# EAGLE schematic *JustABatterie (EAGLE 7.2.0)
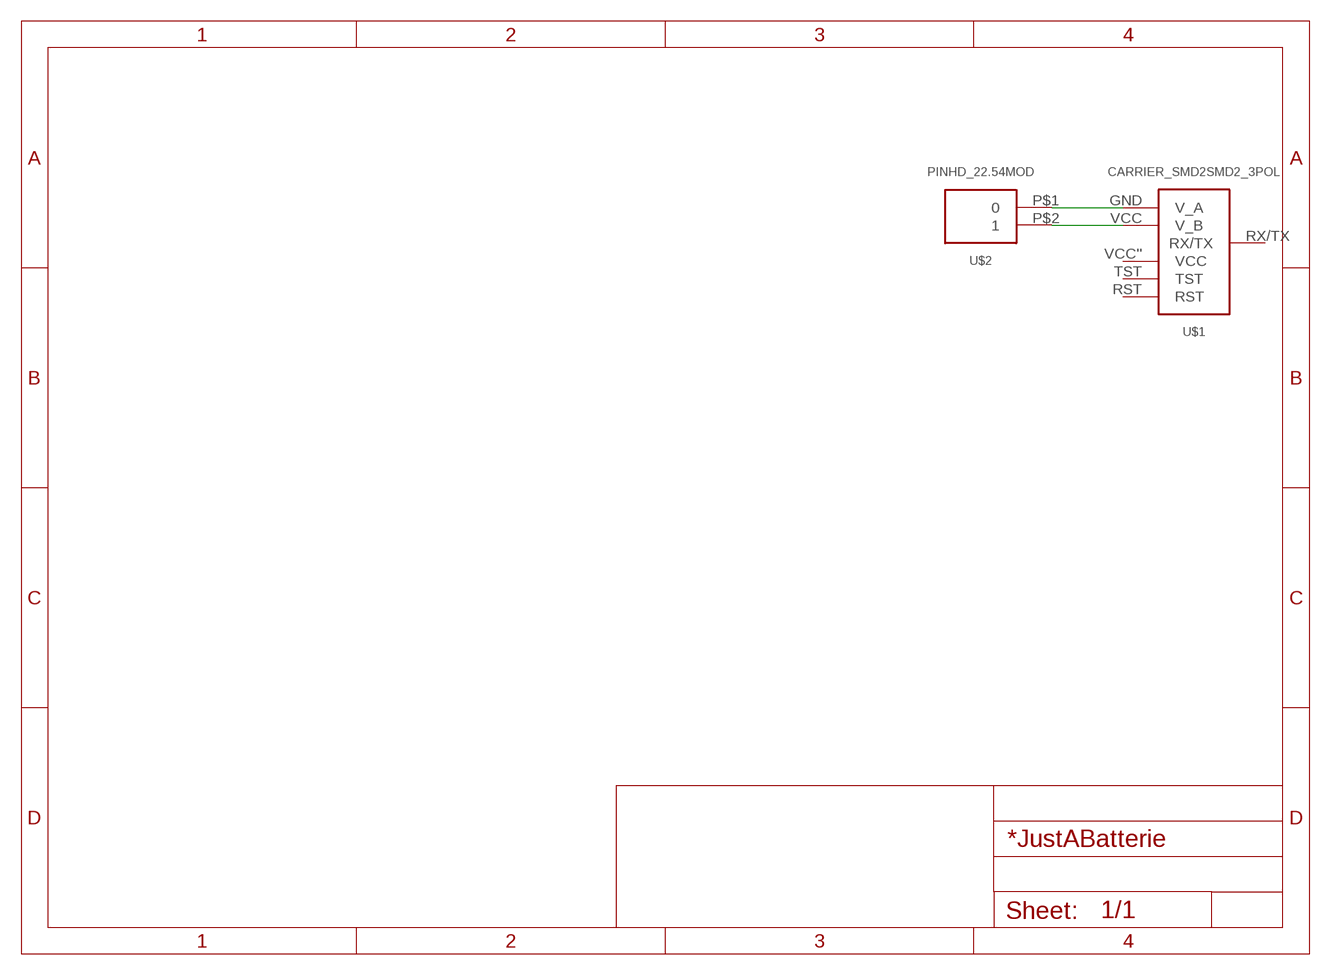
[diagram p0: schematic, sheet 1]

## Parts
U$1  CARRIER_SMD2SMD2_3POL  [CARRIER_SMD2_3POL]
U$2  PINHD_22.54MOD  [PINHD_2_MOD]

## Nets
N$2: U$1.GND(V_A) U$2.P$1
N$3: U$1.VCC(V_B) U$2.P$2
Unconnected: U$1.RST U$1.RX/TX U$1.TST U$1.VCC''(VCC)

## Library data of the parts
U$1 = thar:CARRIER_SMD2
U$2 = thar:PINHD_2